# Altium project PiMX8MP_r0.3_release.PrjPcb (part 6 of 6)

## Sheet 16_FPC_Connector_Debug.SchDoc: FPC Debug Connector
size 420 x 297 mm; CheckedBy: TBD; Author: Lukas Henkel; DocumentNumber: 16; SheetNumber: 16; SheetTotal: 16; DocSize: A3
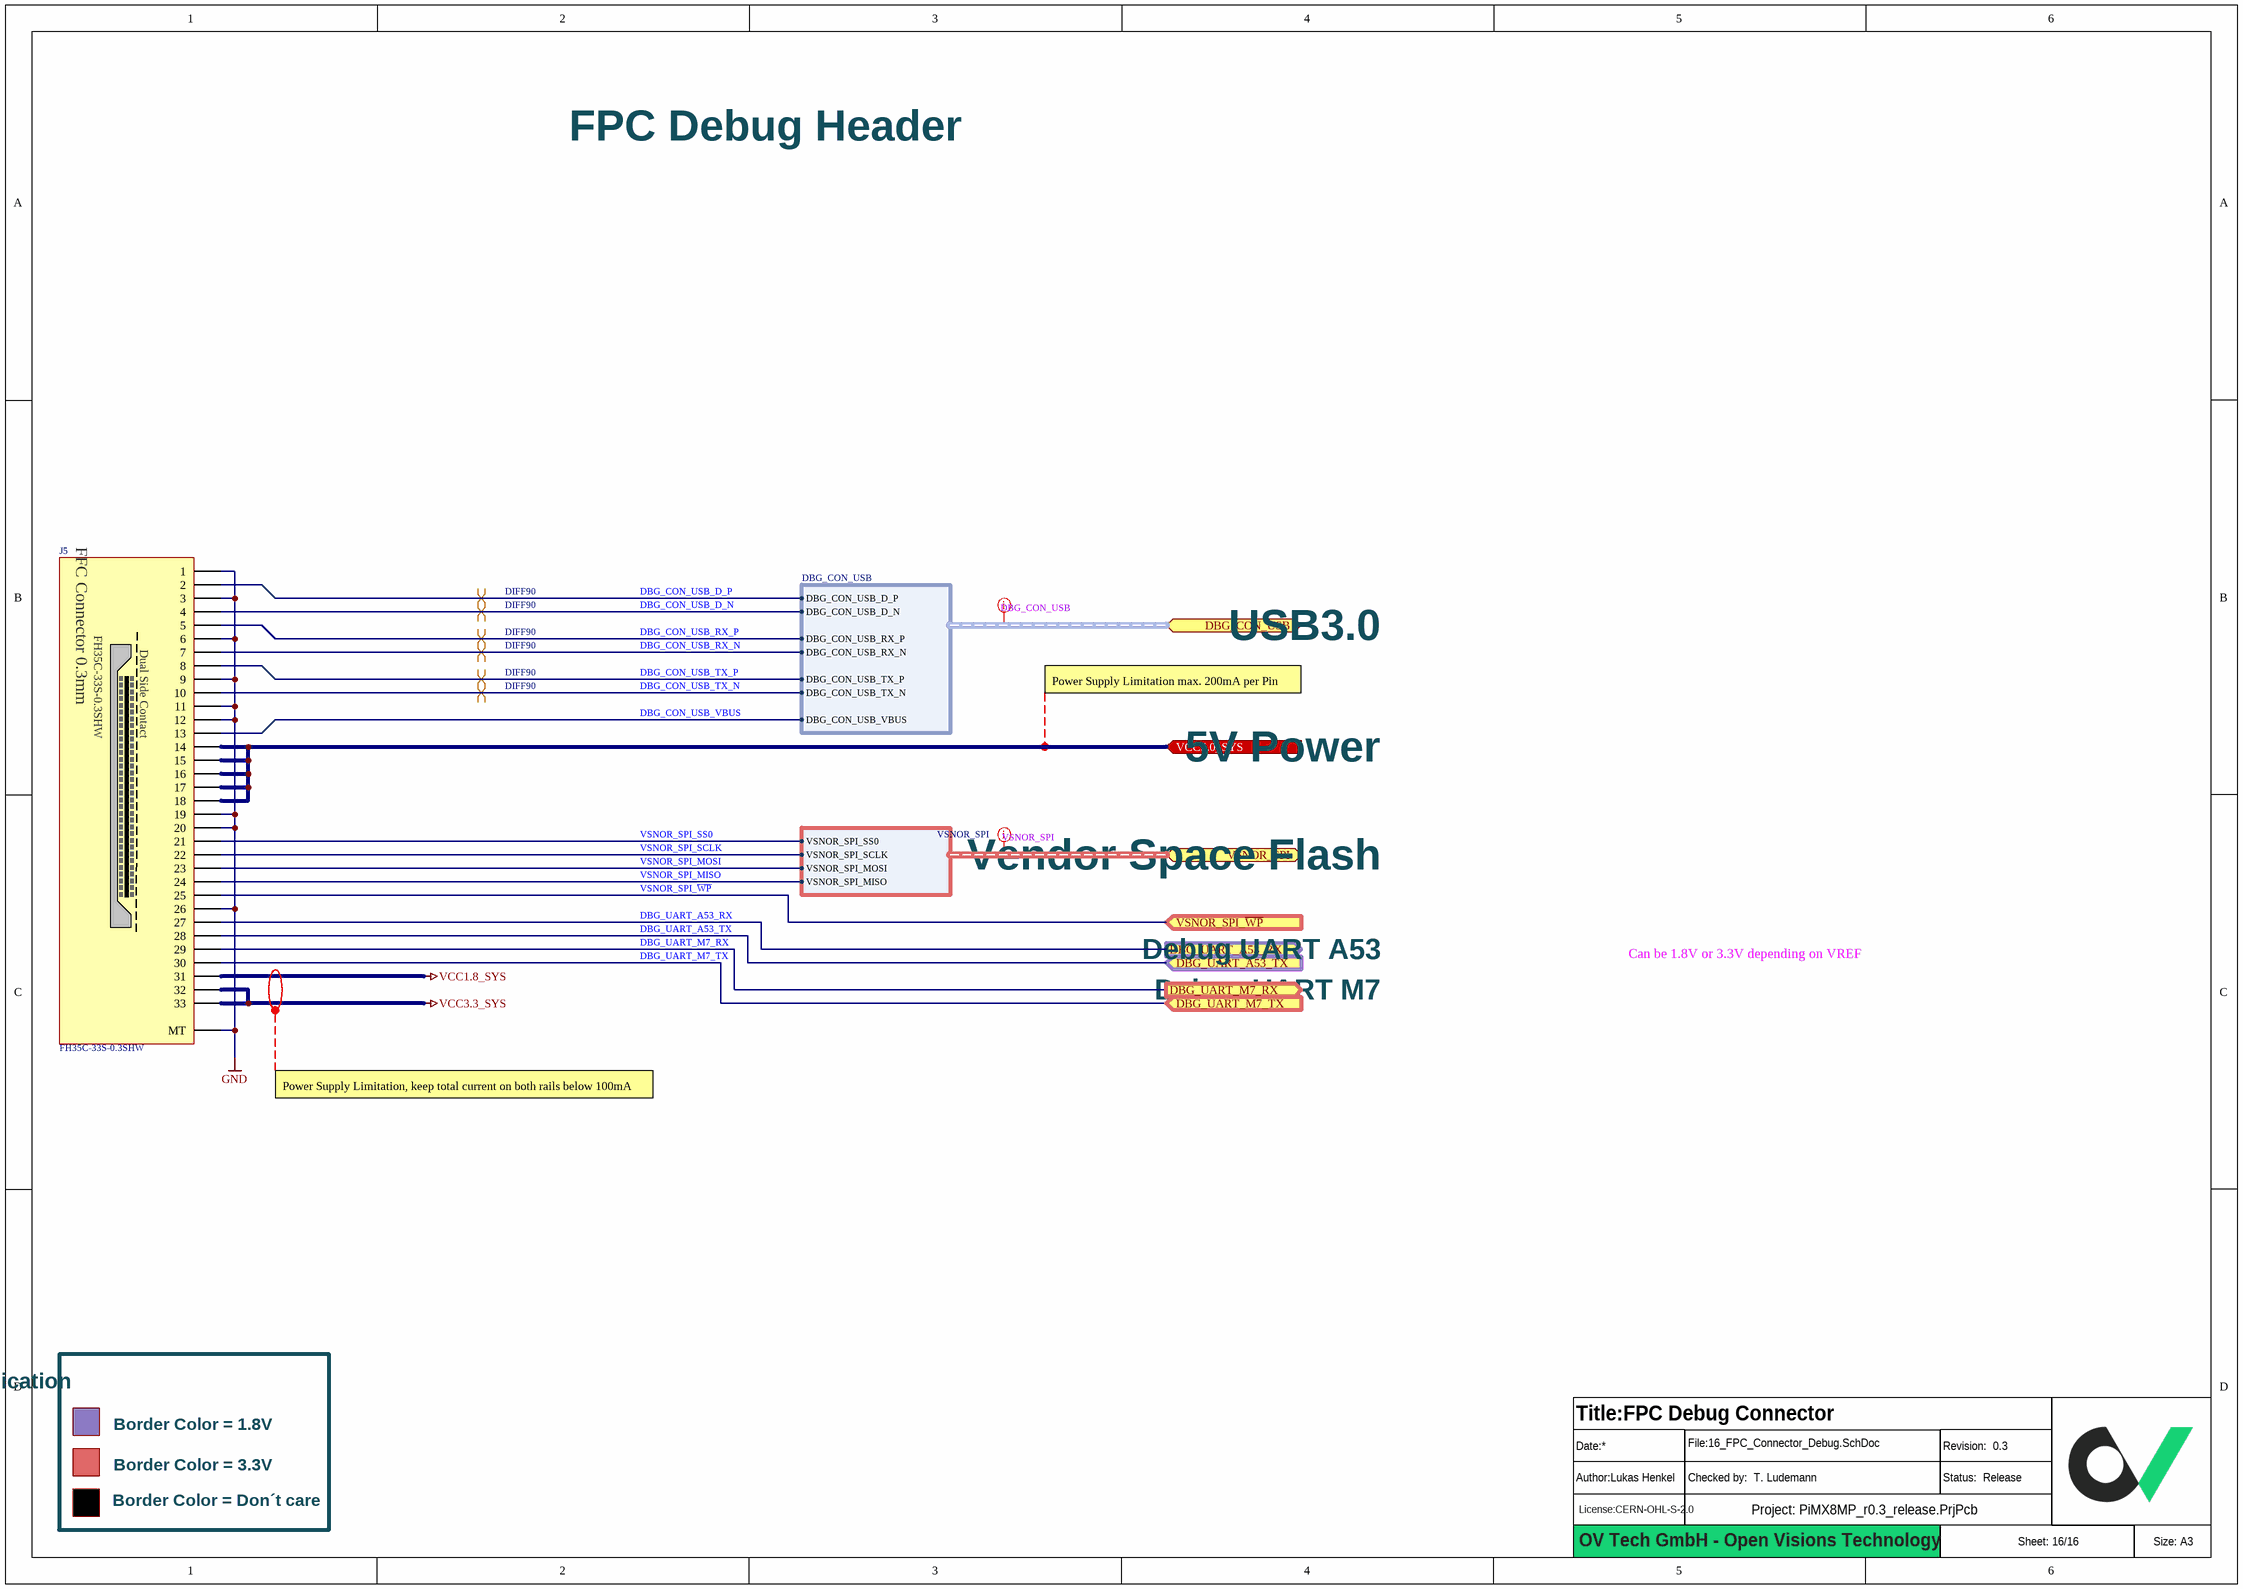
[diagram p16: 16_FPC_Connector_Debug.SchDoc]

### Parts
(Parts that share a designator on the sheet are numbered #1, #2 ... from top to bottom, then left to right.)
?#16  (no value)  (graphical)
J5  FH35C-33S-0.3SHW  [FFC 33pol 0.3mm FH35C-33S-0.3SHW]

### Ports
DBG_CON_USB (bidir, harness DBG_CON_USB), DBG_UART_A53_RX (out), DBG_UART_A53_TX (in), DBG_UART_M7_RX (out), DBG_UART_M7_TX (in), VCC5.0_SYS (in), VSNOR_SPI (bidir, harness VSNOR_SPI), VSNOR_SPI_~{WP} (in)

### Harnesses
DBG_CON_USB: DBG_CON_USB_VBUS, DBG_CON_USB_D_N, DBG_CON_USB_D_P, DBG_CON_USB_RX_N, DBG_CON_USB_RX_P, DBG_CON_USB_TX_N, DBG_CON_USB_TX_P
VSNOR_SPI: VSNOR_SPI_SS0, VSNOR_SPI_SCLK, VSNOR_SPI_MOSI, VSNOR_SPI_MISO

### Nets
GND: J5.1 J5.3 J5.6 J5.9 J5.11 J5.12 J5.19 J5.20 J5.26 J5.MT
VCC1.8_SYS: J5.31
VCC3.3_SYS: J5.32 J5.33
DBG_CON_USB_D_N: J5.4 ; port DBG_CON_USB.DBG_CON_USB_D_N
DBG_CON_USB_D_P: J5.2 ; port DBG_CON_USB.DBG_CON_USB_D_P
DBG_CON_USB_RX_N: J5.7 ; port DBG_CON_USB.DBG_CON_USB_RX_N
DBG_CON_USB_RX_P: J5.5 ; port DBG_CON_USB.DBG_CON_USB_RX_P
DBG_CON_USB_TX_N: J5.10 ; port DBG_CON_USB.DBG_CON_USB_TX_N
DBG_CON_USB_TX_P: J5.8 ; port DBG_CON_USB.DBG_CON_USB_TX_P
DBG_CON_USB_VBUS: J5.13 ; port DBG_CON_USB.DBG_CON_USB_VBUS
DBG_UART_A53_RX: J5.27 ; port DBG_UART_A53_RX
DBG_UART_A53_TX: J5.28 ; port DBG_UART_A53_TX
DBG_UART_M7_RX: J5.29 ; port DBG_UART_M7_RX
DBG_UART_M7_TX: J5.30 ; port DBG_UART_M7_TX
VCC5.0_SYS: J5.14 J5.15 J5.16 J5.17 J5.18 ; port VCC5.0_SYS
VSNOR_SPI_MISO: J5.24 ; port VSNOR_SPI.VSNOR_SPI_MISO
VSNOR_SPI_MOSI: J5.23 ; port VSNOR_SPI.VSNOR_SPI_MOSI
VSNOR_SPI_SCLK: J5.22 ; port VSNOR_SPI.VSNOR_SPI_SCLK
VSNOR_SPI_SS0: J5.21 ; port VSNOR_SPI.VSNOR_SPI_SS0
VSNOR_SPI_~{WP}: J5.25 ; port VSNOR_SPI_~{WP}

### Layout directives
net class DBG_CON_USB: (no net found under the mark)
differential pair; differential pair class DIFF90: DBG_CON_USB_D_N, DBG_CON_USB_D_P, DBG_CON_USB_RX_N, DBG_CON_USB_RX_P, DBG_CON_USB_TX_N, DBG_CON_USB_TX_P
net class VSNOR_SPI: (no net found under the mark)

### Notes on the sheet
- FPC Debug Header
- USB3.0
- Power Supply Limitation max. 200mA per Pin
- 5V Power
- Vendor Space Flash
- Debug UART A53
- Debug UART M7
- Can be 1.8V or 3.3V depending on VREF
- Power Supply Limitation, keep total current on both rails below 100mA
- Signal Level Indication
- Border Color = 1.8V
- Border Color = 3.3V
- Border Color = Don´t care
- OV Tech GmbH - Open Visions Technology
- (in symbol FFC Connector_33pol_FH35C-33S-0.3SHW) FFC Connector 0.3mm; Dual Side Contact

### Library data of the parts
?#16 = Titleblock_01_OpenSource
J5 = FFC Connector_33pol_FH35C-33S-0.3SHW: FFC Connector 33pol 0.3mm Pitch Double Sided Contacts; Manufacturer 1: Hirose Connector; Manufacturer 1 Prt. Nr.: FH35C-33S-0.3SHW(99)

## Nets that join several sheets
DRAM_VCC1.1: 02_8MPLUS_PMIC (5 pins), 03_8MPLUS_PWR (19 pins), 08_DRAM_LPDDR4 (64 pins)
GND: 02_8MPLUS_PMIC (39 pins), 03_8MPLUS_PWR (180 pins), 04_8MPLUS_DRAM (R10.1 R11.1), 05_8MPLUS_CFG (9 pins), 06_8MPLUS_IO (C107.2 C108.2 C109.2 U3.6), 07_8MPLUS_PHY (5 pins), 08_DRAM_LPDDR4 (84 pins), 09_eMMC_Flash (27 pins), 10_Gbit_Ethernet (34 pins), 11_WIFI_BLE_Module (45 pins), 12_Coral_Edge_TPU (105 pins), 13_Interface_Options (7 pins), 14_BTB_Connector_P1-P100 (33 pins), 15_BTB_Connector_P101-P200 (42 pins), 16_FPC_Connector_Debug (10 pins)
VCC1.8_SNVS: 02_8MPLUS_PMIC (C22.1 U1.3), 03_8MPLUS_PWR (C72.1 U2.R24), 05_8MPLUS_CFG (R16.2 R17.2 R18.2 R24.1), 14_BTB_Connector_P1-P100 (R160.2)
VCC1.8_SYS: 02_8MPLUS_PMIC (9 pins), 03_8MPLUS_PWR (15 pins), 05_8MPLUS_CFG (5 pins), 08_DRAM_LPDDR4 (14 pins), 09_eMMC_Flash (18 pins), 10_Gbit_Ethernet (R83.2), 11_WIFI_BLE_Module (R122.2), 12_Coral_Edge_TPU (C198.1 J6.8 R185.1), 14_BTB_Connector_P1-P100 (J3.88 J3.90), 15_BTB_Connector_P101-P200 (R164.2), 16_FPC_Connector_Debug (J5.31)
VCC3.3_SYS: 02_8MPLUS_PMIC (9 pins), 03_8MPLUS_PWR (7 pins), 06_8MPLUS_IO (C108.1 R37.2 R38.2 U3.11), 07_8MPLUS_PHY (R40.1), 09_eMMC_Flash (14 pins), 10_Gbit_Ethernet (8 pins), 11_WIFI_BLE_Module (7 pins), 13_Interface_Options (6 pins), 14_BTB_Connector_P1-P100 (5 pins), 15_BTB_Connector_P101-P200 (R162.2 R163.2 R165.2), 16_FPC_Connector_Debug (J5.32 J5.33)
VCC_ARM: 02_8MPLUS_PMIC (5 pins), 03_8MPLUS_PWR (27 pins)
VCC_SD2: 02_8MPLUS_PMIC (C32.1 R7.2 U1.55), 03_8MPLUS_PWR (C58.1 C59.1 U2.W24)
VCC_SOC: 02_8MPLUS_PMIC (8 pins), 03_8MPLUS_PWR (64 pins)
VCCA1.8_SYS: 02_8MPLUS_PMIC (C29.1 U1.54), 03_8MPLUS_PWR (25 pins), 05_8MPLUS_CFG (C30.1 R9.2 R112.2 U20.4)
8M_BOOT_MODE1: 05_8MPLUS_CFG (5 pins), 14_BTB_Connector_P1-P100 (J3.93)
8M_ONOFF: 05_8MPLUS_CFG (5 pins), 14_BTB_Connector_P1-P100 (R158.2)
ACT_LED_FET: 10_Gbit_Ethernet (R93.1 R100.2 U8.14), 14_BTB_Connector_P1-P100 (U12.5)
ANALOG_P1: 06_8MPLUS_IO (U2.A4), 14_BTB_Connector_P1-P100 (J3.94)
ANALOG_P2: 06_8MPLUS_IO (U2.B5), 14_BTB_Connector_P1-P100 (J3.96)
ANT_SEL: 06_8MPLUS_IO (U2.F6), 11_WIFI_BLE_Module (R115.2 R118.2 U11.6)
BB_CON_CAM0_CLK_N: 07_8MPLUS_PHY (U2.B23), 15_BTB_Connector_P101-P200 (J4.40)
BB_CON_CAM0_CLK_P: 07_8MPLUS_PHY (U2.A23), 15_BTB_Connector_P101-P200 (J4.42)
BB_CON_CAM0_D0_N: 07_8MPLUS_PHY (U2.B25), 15_BTB_Connector_P101-P200 (J4.28)
BB_CON_CAM0_D0_P: 07_8MPLUS_PHY (U2.A25), 15_BTB_Connector_P101-P200 (J4.30)
BB_CON_CAM0_D1_N: 07_8MPLUS_PHY (U2.B24), 15_BTB_Connector_P101-P200 (J4.34)
BB_CON_CAM0_D1_P: 07_8MPLUS_PHY (U2.A24), 15_BTB_Connector_P101-P200 (J4.36)
BB_CON_CAM1_CLK_N: 07_8MPLUS_PHY (U2.E22), 15_BTB_Connector_P101-P200 (J4.27)
BB_CON_CAM1_CLK_P: 07_8MPLUS_PHY (U2.D22), 15_BTB_Connector_P101-P200 (J4.29)
BB_CON_CAM1_D0_N: 07_8MPLUS_PHY (U2.E18), 15_BTB_Connector_P101-P200 (J4.15)
BB_CON_CAM1_D0_P: 07_8MPLUS_PHY (U2.D18), 15_BTB_Connector_P101-P200 (J4.17)
BB_CON_CAM1_D1_N: 07_8MPLUS_PHY (U2.E20), 15_BTB_Connector_P101-P200 (J4.21)
BB_CON_CAM1_D1_P: 07_8MPLUS_PHY (U2.D20), 15_BTB_Connector_P101-P200 (J4.23)
BB_CON_CAM1_D2_N: 07_8MPLUS_PHY (U2.E24), 15_BTB_Connector_P101-P200 (J4.33)
BB_CON_CAM1_D2_P: 07_8MPLUS_PHY (U2.D24), 15_BTB_Connector_P101-P200 (J4.35)
BB_CON_CAM1_D3_N: 07_8MPLUS_PHY (U2.E26), 15_BTB_Connector_P101-P200 (J4.39)
BB_CON_CAM1_D3_P: 07_8MPLUS_PHY (U2.D26), 15_BTB_Connector_P101-P200 (J4.41)
BB_CON_HDMI0_CEC_DYN: 07_8MPLUS_PHY (U2.AD22), 15_BTB_Connector_P101-P200 (D10.2 Q7.2 R173.1)
BB_CON_HDMI0_CLK_N: 07_8MPLUS_PHY (U2.AJ24), 15_BTB_Connector_P101-P200 (J4.90)
BB_CON_HDMI0_CLK_P: 07_8MPLUS_PHY (U2.AH24), 15_BTB_Connector_P101-P200 (J4.88)
BB_CON_HDMI0_HPD_DYN: 07_8MPLUS_PHY (U2.AE22), 15_BTB_Connector_P101-P200 (R168.1 U22.B2)
BB_CON_HDMI0_SCL_DYN: 07_8MPLUS_PHY (U2.AC22), 15_BTB_Connector_P101-P200 (R171.1 U18.2)
BB_CON_HDMI0_SDA_DYN: 07_8MPLUS_PHY (U2.AF22), 15_BTB_Connector_P101-P200 (R172.1 U18.3)
BB_CON_HDMI0_TX0_N: 07_8MPLUS_PHY (U2.AJ25), 15_BTB_Connector_P101-P200 (J4.84)
BB_CON_HDMI0_TX0_P: 07_8MPLUS_PHY (U2.AH25), 15_BTB_Connector_P101-P200 (J4.82)
BB_CON_HDMI0_TX1_N: 07_8MPLUS_PHY (U2.AJ26), 15_BTB_Connector_P101-P200 (J4.78)
BB_CON_HDMI0_TX1_P: 07_8MPLUS_PHY (U2.AH26), 15_BTB_Connector_P101-P200 (J4.76)
BB_CON_HDMI0_TX2_N: 07_8MPLUS_PHY (U2.AJ27), 15_BTB_Connector_P101-P200 (J4.72)
BB_CON_HDMI0_TX2_P: 07_8MPLUS_PHY (U2.AH27), 15_BTB_Connector_P101-P200 (J4.70)
BB_CON_LVDS/DSI_CLK_N: 13_Interface_Options (U16.10), 15_BTB_Connector_P101-P200 (J4.87)
BB_CON_LVDS/DSI_CLK_P: 13_Interface_Options (U16.11), 15_BTB_Connector_P101-P200 (J4.89)
BB_CON_LVDS/DSI_D0_N: 13_Interface_Options (U16.5), 15_BTB_Connector_P101-P200 (J4.75)
BB_CON_LVDS/DSI_D0_P: 13_Interface_Options (U16.6), 15_BTB_Connector_P101-P200 (J4.77)
BB_CON_LVDS/DSI_D1_N: 13_Interface_Options (U16.7), 15_BTB_Connector_P101-P200 (J4.81)
BB_CON_LVDS/DSI_D1_P: 13_Interface_Options (U16.8), 15_BTB_Connector_P101-P200 (J4.83)
BB_CON_LVDS/DSI_D2_N: 13_Interface_Options (U16.12), 15_BTB_Connector_P101-P200 (J4.93)
BB_CON_LVDS/DSI_D2_P: 13_Interface_Options (U16.13), 15_BTB_Connector_P101-P200 (J4.95)
BB_CON_LVDS/DSI_D3_N: 13_Interface_Options (U16.15), 15_BTB_Connector_P101-P200 (J4.94)
BB_CON_LVDS/DSI_D3_P: 13_Interface_Options (U16.14), 15_BTB_Connector_P101-P200 (J4.96)
BB_CON_PCIE_CLK_N: 13_Interface_Options (R147.1), 15_BTB_Connector_P101-P200 (J4.12)
BB_CON_PCIE_CLK_P: 13_Interface_Options (R146.1), 15_BTB_Connector_P101-P200 (J4.10)
BB_CON_PCIe_CLK_REQ: 06_8MPLUS_IO (U2.AF8), 15_BTB_Connector_P101-P200 (J4.2 R165.1)
BB_CON_PCIE_RST: 06_8MPLUS_IO (U2.AD8), 15_BTB_Connector_P101-P200 (J4.9 R163.1)
BB_CON_PCIE_RX_N: 13_Interface_Options (R143.1), 15_BTB_Connector_P101-P200 (J4.18)
BB_CON_PCIE_RX_P: 13_Interface_Options (R142.1), 15_BTB_Connector_P101-P200 (J4.16)
BB_CON_PCIEC_TX_N: 13_Interface_Options (R145.1), 15_BTB_Connector_P101-P200 (J4.24)
BB_CON_PCIEC_TX_P: 13_Interface_Options (R144.1), 15_BTB_Connector_P101-P200 (J4.22)
BB_CON_USB_D_N: 07_8MPLUS_PHY (R42.2), 15_BTB_Connector_P101-P200 (J4.3)
BB_CON_USB_D_P: 07_8MPLUS_PHY (R43.2), 15_BTB_Connector_P101-P200 (J4.5)
BB_CON_USB_ID: 06_8MPLUS_IO (U2.B7), 15_BTB_Connector_P101-P200 (D4.2 R164.1)
BT_DEVICE_WAKE: 06_8MPLUS_IO (U2.AE8), 11_WIFI_BLE_Module (U10.51)
BT_HOST_WAKE: 06_8MPLUS_IO (U2.A7), 11_WIFI_BLE_Module (R183.1 R184.2)
BT_PCM_CLK: 06_8MPLUS_IO (U3.8), 11_WIFI_BLE_Module (U10.7)
BT_PCM_IN: 06_8MPLUS_IO (U3.9), 11_WIFI_BLE_Module (U10.6)
BT_PCM_OUT: 06_8MPLUS_IO (U3.7), 11_WIFI_BLE_Module (U10.9)
BT_PCM_SYNC: 06_8MPLUS_IO (U3.10), 11_WIFI_BLE_Module (U10.8)
BT_REG_EN: 06_8MPLUS_IO (U2.AA29), 11_WIFI_BLE_Module (C177.1 R106.1 U10.68), 14_BTB_Connector_P1-P100 (J3.91)
BT_UART_CTS_N: 06_8MPLUS_IO (U2.W25), 11_WIFI_BLE_Module (U10.11)
BT_UART_RTS_N: 06_8MPLUS_IO (U2.W26), 11_WIFI_BLE_Module (U10.13)
BT_UART_RXD: 06_8MPLUS_IO (U2.AA28), 11_WIFI_BLE_Module (U10.12)
BT_UART_TXD: 06_8MPLUS_IO (U2.U25), 11_WIFI_BLE_Module (U10.10)
CAMERA_GPIO: 06_8MPLUS_IO (U2.AE6), 14_BTB_Connector_P1-P100 (J3.97)
CM4_GPIO0: 06_8MPLUS_IO (U2.AF14), 14_BTB_Connector_P1-P100 (J3.36)
CM4_GPIO1: 06_8MPLUS_IO (U2.AE16), 14_BTB_Connector_P1-P100 (J3.35)
CM4_GPIO2: 06_8MPLUS_IO (U2.AD14), 14_BTB_Connector_P1-P100 (J3.58)
CM4_GPIO3: 06_8MPLUS_IO (U2.AC14), 14_BTB_Connector_P1-P100 (J3.56)
CM4_GPIO4: 06_8MPLUS_IO (U2.AH14), 14_BTB_Connector_P1-P100 (J3.54)
CM4_GPIO5: 06_8MPLUS_IO (U2.AJ12), 14_BTB_Connector_P1-P100 (J3.34)
CM4_GPIO6: 06_8MPLUS_IO (U2.AF12), 14_BTB_Connector_P1-P100 (J3.30)
CM4_GPIO7: 06_8MPLUS_IO (U2.AJ10), 14_BTB_Connector_P1-P100 (J3.37)
CM4_GPIO8: 06_8MPLUS_IO (U2.AJ22), 14_BTB_Connector_P1-P100 (J3.39)
CM4_GPIO9: 06_8MPLUS_IO (U2.AH20), 14_BTB_Connector_P1-P100 (J3.40)
CM4_GPIO10: 06_8MPLUS_IO (U2.AJ21), 14_BTB_Connector_P1-P100 (J3.44)
CM4_GPIO11: 06_8MPLUS_IO (U2.AH21), 14_BTB_Connector_P1-P100 (J3.38)
CM4_GPIO12: 06_8MPLUS_IO (R32.1 U2.AJ11), 14_BTB_Connector_P1-P100 (J3.31)
CM4_GPIO13: 06_8MPLUS_IO (R33.1 U2.AH11), 14_BTB_Connector_P1-P100 (J3.28)
CM4_GPIO14: 06_8MPLUS_IO (R36.1 U2.AC16), 14_BTB_Connector_P1-P100 (J3.55)
CM4_GPIO15: 06_8MPLUS_IO (R34.1 U2.AH19), 14_BTB_Connector_P1-P100 (J3.51)
CM4_GPIO16: 06_8MPLUS_IO (U2.AH10), 14_BTB_Connector_P1-P100 (J3.29)
CM4_GPIO17: 06_8MPLUS_IO (U2.AH13), 14_BTB_Connector_P1-P100 (J3.50)
CM4_GPIO18: 06_8MPLUS_IO (R35.1 U2.AE20), 14_BTB_Connector_P1-P100 (J3.49)
CM4_GPIO19: 06_8MPLUS_IO (R31.1 U2.AD20), 14_BTB_Connector_P1-P100 (J3.26)
CM4_GPIO20: 06_8MPLUS_IO (U2.AC20), 14_BTB_Connector_P1-P100 (J3.27)
CM4_GPIO21: 06_8MPLUS_IO (U2.AF20), 14_BTB_Connector_P1-P100 (J3.25)
CM4_GPIO22: 06_8MPLUS_IO (U2.AH9), 14_BTB_Connector_P1-P100 (J3.46)
CM4_GPIO23: 06_8MPLUS_IO (U2.AD10), 14_BTB_Connector_P1-P100 (J3.47)
CM4_GPIO24: 06_8MPLUS_IO (U2.AD12), 14_BTB_Connector_P1-P100 (J3.45)
CM4_GPIO25: 06_8MPLUS_IO (U2.AE10), 14_BTB_Connector_P1-P100 (J3.41)
CM4_GPIO26: 06_8MPLUS_IO (U2.AH12), 14_BTB_Connector_P1-P100 (J3.24)
CM4_GPIO27: 06_8MPLUS_IO (U2.AJ8), 14_BTB_Connector_P1-P100 (J3.48)
CON_SCL0: 13_Interface_Options (R149.1 U17.16), 14_BTB_Connector_P1-P100 (J3.80)
CON_SDA0: 13_Interface_Options (R150.1 U17.3), 14_BTB_Connector_P1-P100 (J3.82)
CPU_ACIVITY_LED: 06_8MPLUS_IO (U2.A5), 14_BTB_Connector_P1-P100 (R151.1 R152.1)
DBG_CON_USB_D_N: 07_8MPLUS_PHY (U2.E14), 16_FPC_Connector_Debug (J5.4)
DBG_CON_USB_D_P: 07_8MPLUS_PHY (U2.D14), 16_FPC_Connector_Debug (J5.2)
DBG_CON_USB_RX_N: 07_8MPLUS_PHY (U2.B12), 16_FPC_Connector_Debug (J5.7)
DBG_CON_USB_RX_P: 07_8MPLUS_PHY (U2.A12), 16_FPC_Connector_Debug (J5.5)
DBG_CON_USB_TX_N: 07_8MPLUS_PHY (C112.2), 16_FPC_Connector_Debug (J5.10)
DBG_CON_USB_TX_P: 07_8MPLUS_PHY (C113.2), 16_FPC_Connector_Debug (J5.8)
DBG_CON_USB_VBUS: 07_8MPLUS_PHY (U2.D12), 16_FPC_Connector_Debug (J5.13)
DBG_UART_A53_RX: 06_8MPLUS_IO (R34.2), 16_FPC_Connector_Debug (J5.27)
DBG_UART_A53_TX: 06_8MPLUS_IO (R36.2), 16_FPC_Connector_Debug (J5.28)
DBG_UART_M7_RX: 06_8MPLUS_IO (U2.AJ5), 16_FPC_Connector_Debug (J5.29)
DBG_UART_M7_TX: 06_8MPLUS_IO (U2.AH5), 16_FPC_Connector_Debug (J5.30)
DRAM_A_CA0: 04_8MPLUS_DRAM (U2.L6), 08_DRAM_LPDDR4 (U4.R2)
DRAM_A_CA1: 04_8MPLUS_DRAM (U2.L4), 08_DRAM_LPDDR4 (U4.P2)
DRAM_A_CA2: 04_8MPLUS_DRAM (U2.E4), 08_DRAM_LPDDR4 (U4.R9)
DRAM_A_CA3: 04_8MPLUS_DRAM (U2.D4), 08_DRAM_LPDDR4 (U4.R10)
DRAM_A_CA4: 04_8MPLUS_DRAM (U2.N4), 08_DRAM_LPDDR4 (U4.R11)
DRAM_A_CA5: 04_8MPLUS_DRAM (U2.N5), 08_DRAM_LPDDR4 (U4.P11)
DRAM_A_CKE0: 04_8MPLUS_DRAM (U2.J6), 08_DRAM_LPDDR4 (R53.2 U4.P4)
DRAM_A_CKE1: 04_8MPLUS_DRAM (U2.G5), 08_DRAM_LPDDR4 (R52.2 U4.P5)
DRAM_A_CLK_N: 04_8MPLUS_DRAM (U2.M2), 08_DRAM_LPDDR4 (R56.2 U4.P9)
DRAM_A_CLK_P: 04_8MPLUS_DRAM (U2.M1), 08_DRAM_LPDDR4 (R56.1 U4.P8)
DRAM_A_CS0: 04_8MPLUS_DRAM (U2.N6), 08_DRAM_LPDDR4 (U4.R4)
DRAM_A_CS1: 04_8MPLUS_DRAM (U2.J4), 08_DRAM_LPDDR4 (U4.R3)
DRAM_A_DATA0: 04_8MPLUS_DRAM (U2.B3), 08_DRAM_LPDDR4 (U4.AA11)
DRAM_A_DATA1: 04_8MPLUS_DRAM (U2.A2), 08_DRAM_LPDDR4 (U4.Y11)
DRAM_A_DATA2: 04_8MPLUS_DRAM (U2.E1), 08_DRAM_LPDDR4 (U4.V11)
DRAM_A_DATA3: 04_8MPLUS_DRAM (U2.F2), 08_DRAM_LPDDR4 (U4.U11)
DRAM_A_DATA4: 04_8MPLUS_DRAM (U2.E2), 08_DRAM_LPDDR4 (U4.U9)
DRAM_A_DATA5: 04_8MPLUS_DRAM (U2.C1), 08_DRAM_LPDDR4 (U4.V9)
DRAM_A_DATA6: 04_8MPLUS_DRAM (U2.C2), 08_DRAM_LPDDR4 (U4.Y9)
DRAM_A_DATA7: 04_8MPLUS_DRAM (U2.B1), 08_DRAM_LPDDR4 (U4.AA9)
DRAM_A_DATA8: 04_8MPLUS_DRAM (U2.G1), 08_DRAM_LPDDR4 (U4.AA2)
DRAM_A_DATA9: 04_8MPLUS_DRAM (U2.H1), 08_DRAM_LPDDR4 (U4.Y2)
DRAM_A_DATA10: 04_8MPLUS_DRAM (U2.K1), 08_DRAM_LPDDR4 (U4.V2)
DRAM_A_DATA11: 04_8MPLUS_DRAM (U2.K2), 08_DRAM_LPDDR4 (U4.U2)
DRAM_A_DATA12: 04_8MPLUS_DRAM (U2.L2), 08_DRAM_LPDDR4 (U4.U4)
DRAM_A_DATA13: 04_8MPLUS_DRAM (U2.L1), 08_DRAM_LPDDR4 (U4.V4)
DRAM_A_DATA14: 04_8MPLUS_DRAM (U2.G2), 08_DRAM_LPDDR4 (U4.Y4)
DRAM_A_DATA15: 04_8MPLUS_DRAM (U2.F1), 08_DRAM_LPDDR4 (U4.AA4)
DRAM_A_DMI0: 04_8MPLUS_DRAM (U2.B2), 08_DRAM_LPDDR4 (U4.Y10)
DRAM_A_DMI1: 04_8MPLUS_DRAM (U2.H2), 08_DRAM_LPDDR4 (U4.Y3)
DRAM_A_DQS0_N: 04_8MPLUS_DRAM (U2.D1), 08_DRAM_LPDDR4 (U4.V10)
DRAM_A_DQS0_P: 04_8MPLUS_DRAM (U2.D2), 08_DRAM_LPDDR4 (U4.W10)
DRAM_A_DQS1_N: 04_8MPLUS_DRAM (U2.J1), 08_DRAM_LPDDR4 (U4.V3)
DRAM_A_DQS1_P: 04_8MPLUS_DRAM (U2.J2), 08_DRAM_LPDDR4 (U4.W3)
DRAM_B_CA0: 04_8MPLUS_DRAM (U2.W4), 08_DRAM_LPDDR4 (U4.H2)
DRAM_B_CA1: 04_8MPLUS_DRAM (U2.W5), 08_DRAM_LPDDR4 (U4.J2)
DRAM_B_CA2: 04_8MPLUS_DRAM (U2.AE4), 08_DRAM_LPDDR4 (U4.H9)
DRAM_B_CA3: 04_8MPLUS_DRAM (U2.AF4), 08_DRAM_LPDDR4 (U4.H10)
DRAM_B_CA4: 04_8MPLUS_DRAM (U2.U5), 08_DRAM_LPDDR4 (U4.H11)
DRAM_B_CA5: 04_8MPLUS_DRAM (U2.U6), 08_DRAM_LPDDR4 (U4.J11)
DRAM_B_CKE0: 04_8MPLUS_DRAM (U2.AA4), 08_DRAM_LPDDR4 (R50.2 U4.J4)
DRAM_B_CKE1: 04_8MPLUS_DRAM (U2.AA5), 08_DRAM_LPDDR4 (R49.2 U4.J5)
DRAM_B_CLK_N: 04_8MPLUS_DRAM (U2.V1), 08_DRAM_LPDDR4 (R57.2 U4.J9)
DRAM_B_CLK_P: 04_8MPLUS_DRAM (U2.V2), 08_DRAM_LPDDR4 (R57.1 U4.J8)
DRAM_B_CS0: 04_8MPLUS_DRAM (U2.U4), 08_DRAM_LPDDR4 (U4.H4)
DRAM_B_CS1: 04_8MPLUS_DRAM (U2.AA6), 08_DRAM_LPDDR4 (U4.H3)
DRAM_B_DATA0: 04_8MPLUS_DRAM (U2.AC1), 08_DRAM_LPDDR4 (U4.B2)
DRAM_B_DATA1: 04_8MPLUS_DRAM (U2.AB1), 08_DRAM_LPDDR4 (U4.C2)
DRAM_B_DATA2: 04_8MPLUS_DRAM (U2.Y1), 08_DRAM_LPDDR4 (U4.E2)
DRAM_B_DATA3: 04_8MPLUS_DRAM (U2.Y2), 08_DRAM_LPDDR4 (U4.F2)
DRAM_B_DATA4: 04_8MPLUS_DRAM (U2.W2), 08_DRAM_LPDDR4 (U4.F4)
DRAM_B_DATA5: 04_8MPLUS_DRAM (U2.W1), 08_DRAM_LPDDR4 (U4.E4)
DRAM_B_DATA6: 04_8MPLUS_DRAM (U2.AC2), 08_DRAM_LPDDR4 (U4.C4)
DRAM_B_DATA7: 04_8MPLUS_DRAM (U2.AD1), 08_DRAM_LPDDR4 (U4.B4)
DRAM_B_DATA8: 04_8MPLUS_DRAM (U2.AH3), 08_DRAM_LPDDR4 (U4.B11)
DRAM_B_DATA9: 04_8MPLUS_DRAM (U2.AJ2), 08_DRAM_LPDDR4 (U4.C11)
DRAM_B_DATA10: 04_8MPLUS_DRAM (U2.AE1), 08_DRAM_LPDDR4 (U4.E11)
DRAM_B_DATA11: 04_8MPLUS_DRAM (U2.AD2), 08_DRAM_LPDDR4 (U4.F11)
DRAM_B_DATA12: 04_8MPLUS_DRAM (U2.AE2), 08_DRAM_LPDDR4 (U4.F9)
DRAM_B_DATA13: 04_8MPLUS_DRAM (U2.AG1), 08_DRAM_LPDDR4 (U4.E9)
DRAM_B_DATA14: 04_8MPLUS_DRAM (U2.AG2), 08_DRAM_LPDDR4 (U4.C9)
DRAM_B_DATA15: 04_8MPLUS_DRAM (U2.AH1), 08_DRAM_LPDDR4 (U4.B9)
DRAM_B_DMI0: 04_8MPLUS_DRAM (U2.AB2), 08_DRAM_LPDDR4 (U4.C3)
DRAM_B_DMI1: 04_8MPLUS_DRAM (U2.AH2), 08_DRAM_LPDDR4 (U4.C10)
DRAM_B_DQS0_N: 04_8MPLUS_DRAM (U2.AA1), 08_DRAM_LPDDR4 (U4.E3)
DRAM_B_DQS0_P: 04_8MPLUS_DRAM (U2.AA2), 08_DRAM_LPDDR4 (U4.D3)
DRAM_B_DQS1_N: 04_8MPLUS_DRAM (U2.AF1), 08_DRAM_LPDDR4 (U4.E10)
DRAM_B_DQS1_P: 04_8MPLUS_DRAM (U2.AF2), 08_DRAM_LPDDR4 (U4.D10)
DRAM_RESET: 04_8MPLUS_DRAM (R10.2 TP23.TP U2.T1), 08_DRAM_LPDDR4 (U4.T11)
DSI1_CLK_N: 07_8MPLUS_PHY (U2.B18), 13_Interface_Options (U16.34)
DSI1_CLK_P: 07_8MPLUS_PHY (U2.A18), 13_Interface_Options (U16.33)
DSI1_D0_N: 07_8MPLUS_PHY (U2.B16), 13_Interface_Options (U16.38)
DSI1_D0_P: 07_8MPLUS_PHY (U2.A16), 13_Interface_Options (U16.37)
DSI1_D1_N: 07_8MPLUS_PHY (U2.B17), 13_Interface_Options (U16.36)
DSI1_D1_P: 07_8MPLUS_PHY (U2.A17), 13_Interface_Options (U16.35)
DSI1_D2_N: 07_8MPLUS_PHY (U2.B19), 13_Interface_Options (U16.32)
DSI1_D2_P: 07_8MPLUS_PHY (U2.A19), 13_Interface_Options (U16.31)
DSI1_D3_N: 07_8MPLUS_PHY (U2.B20), 13_Interface_Options (U16.18)
DSI1_D3_P: 07_8MPLUS_PHY (U2.A20), 13_Interface_Options (U16.19)
ENET_125O_SYNCE: 10_Gbit_Ethernet (R98.1 TP70.TP), 14_BTB_Connector_P1-P100 (J3.16)
ENET_~{INT}: 06_8MPLUS_IO (U2.A3), 10_Gbit_Ethernet (R75.1 TP67.TP U8.39)
ENET_LED1_ACTIVITY: 10_Gbit_Ethernet (R94.1 R101.2 U8.18), 14_BTB_Connector_P1-P100 (U12.1)
ENET_LED2_LINK: 10_Gbit_Ethernet (R95.1 R102.2 U8.16), 14_BTB_Connector_P1-P100 (U12.3)
ENET_LED3/GPIO2: 10_Gbit_Ethernet (R96.1 R103.2 TP71.TP U8.15), 14_BTB_Connector_P1-P100 (J3.18)
ENET_MDC: 06_8MPLUS_IO (U2.AH28), 10_Gbit_Ethernet (TP61.TP U8.37)
ENET_MDIO: 06_8MPLUS_IO (U2.AH29), 10_Gbit_Ethernet (R73.1 TP63.TP U8.38)
ENET_~{RST}: 02_8MPLUS_PMIC (R3.2), 10_Gbit_Ethernet (R74.1 TP64.TP U8.43)
ENET_RD0: 06_8MPLUS_IO (U2.AG29), 10_Gbit_Ethernet (R76.1)
ENET_RD1: 06_8MPLUS_IO (U2.AG28), 10_Gbit_Ethernet (R77.1)
ENET_RD2: 06_8MPLUS_IO (U2.AF29), 10_Gbit_Ethernet (R78.1)
ENET_RD3: 06_8MPLUS_IO (U2.AF28), 10_Gbit_Ethernet (R79.1)
ENET_RX_CTL: 06_8MPLUS_IO (U2.AE28), 10_Gbit_Ethernet (R82.1)
ENET_RXC: 06_8MPLUS_IO (U2.AE29), 10_Gbit_Ethernet (R81.1)
ENET_TD0: 06_8MPLUS_IO (U2.AC25), 10_Gbit_Ethernet (R177.1)
ENET_TD1: 06_8MPLUS_IO (U2.AE26), 10_Gbit_Ethernet (R178.1)
ENET_TD2: 06_8MPLUS_IO (U2.AF26), 10_Gbit_Ethernet (R179.1)
ENET_TD3: 06_8MPLUS_IO (U2.AD24), 10_Gbit_Ethernet (R180.1)
ENET_TX_CTL: 06_8MPLUS_IO (U2.AF24), 10_Gbit_Ethernet (R182.1)
ENET_TXC: 06_8MPLUS_IO (U2.AE24), 10_Gbit_Ethernet (R181.1)
ETH_TRX0_N: 10_Gbit_Ethernet (U8.3), 14_BTB_Connector_P1-P100 (J3.10)
ETH_TRX0_P: 10_Gbit_Ethernet (U8.2), 14_BTB_Connector_P1-P100 (J3.12)
ETH_TRX1_N: 10_Gbit_Ethernet (U8.6), 14_BTB_Connector_P1-P100 (J3.6)
ETH_TRX1_P: 10_Gbit_Ethernet (U8.5), 14_BTB_Connector_P1-P100 (J3.4)
ETH_TRX2_N: 10_Gbit_Ethernet (U8.8), 14_BTB_Connector_P1-P100 (J3.9)
ETH_TRX2_P: 10_Gbit_Ethernet (U8.7), 14_BTB_Connector_P1-P100 (J3.11)
ETH_TRX3_N: 10_Gbit_Ethernet (U8.11), 14_BTB_Connector_P1-P100 (J3.5)
ETH_TRX3_P: 10_Gbit_Ethernet (U8.10), 14_BTB_Connector_P1-P100 (J3.3)
GPIO_VREF: 03_8MPLUS_PWR (7 pins), 06_8MPLUS_IO (C107.1 U3.1 U3.12), 14_BTB_Connector_P1-P100 (J3.78), 15_BTB_Connector_P101-P200 (9 pins)
LVDS0_CLK_N: 07_8MPLUS_PHY (U2.G28), 13_Interface_Options (U16.25)
LVDS0_CLK_P: 07_8MPLUS_PHY (U2.F29), 13_Interface_Options (U16.24)
LVDS0_TX0_N: 07_8MPLUS_PHY (U2.E28), 13_Interface_Options (U16.29)
LVDS0_TX0_P: 07_8MPLUS_PHY (U2.D29), 13_Interface_Options (U16.28)
LVDS0_TX1_N: 07_8MPLUS_PHY (U2.F28), 13_Interface_Options (U16.27)
LVDS0_TX1_P: 07_8MPLUS_PHY (U2.E29), 13_Interface_Options (U16.26)
LVDS0_TX2_N: 07_8MPLUS_PHY (U2.H28), 13_Interface_Options (U16.23)
LVDS0_TX2_P: 07_8MPLUS_PHY (U2.G29), 13_Interface_Options (U16.22)
LVDS0_TX3_N: 07_8MPLUS_PHY (U2.J28), 13_Interface_Options (U16.20)
LVDS0_TX3_P: 07_8MPLUS_PHY (U2.H29), 13_Interface_Options (U16.21)
LVDS/DSI_SEL: 06_8MPLUS_IO (U2.E8), 13_Interface_Options (R148.2 TP94.TP U16.17)
PCIE_CLK_N: 07_8MPLUS_PHY (U2.E16), 13_Interface_Options (R141.1 R147.2)
PCIE_CLK_P: 07_8MPLUS_PHY (U2.D16), 13_Interface_Options (R140.1 R146.2)
PCIE_RX_N: 07_8MPLUS_PHY (U2.B14), 13_Interface_Options (R137.1 R143.2)
PCIE_RX_P: 07_8MPLUS_PHY (U2.A14), 13_Interface_Options (R136.1 R142.2)
PCIEC_TX_N: 07_8MPLUS_PHY (C110.2), 13_Interface_Options (R139.1 R145.2)
PCIEC_TX_P: 07_8MPLUS_PHY (C111.2), 13_Interface_Options (R138.1 R144.2)
PMIC_32K_OUT: 02_8MPLUS_PMIC (TP10.TP U1.7), 05_8MPLUS_CFG (U2.J25), 11_WIFI_BLE_Module (U12.11)
PMIC_INT_B: 02_8MPLUS_PMIC (R4.2 TP11.TP U1.13), 06_8MPLUS_IO (U2.D6)
PMIC_ON_REQ: 02_8MPLUS_PMIC (TP15.TP U1.39), 05_8MPLUS_CFG (R18.1 U2.F22)
PMIC_POR_B: 02_8MPLUS_PMIC (R3.1 TP12.TP U1.9), 05_8MPLUS_CFG (R17.1 U2.J29), 14_BTB_Connector_P1-P100 (D2.2 R157.1 U12.13)
PMIC_SCL: 02_8MPLUS_PMIC (R176.1 TP8.TP U1.41), 06_8MPLUS_IO (U2.AC8)
PMIC_SDA: 02_8MPLUS_PMIC (R175.1 TP9.TP U1.42), 06_8MPLUS_IO (U2.AH7)
PMIC_STBY_REQ: 02_8MPLUS_PMIC (TP14.TP U1.40), 05_8MPLUS_CFG (U2.J24)
R_SNSP1: 02_8MPLUS_PMIC (R2.1 TP6.TP U1.38), 03_8MPLUS_PWR (NT2.1)
R_SNSP2: 02_8MPLUS_PMIC (R1.1 TP3.TP U1.44), 03_8MPLUS_PWR (NT1.1)
SCI_I2C_SCL: 06_8MPLUS_IO (R38.1 U2.AJ7), 13_Interface_Options (R149.2 U17.10)
SCI_I2C_SDA: 06_8MPLUS_IO (R37.1 U2.AJ6), 13_Interface_Options (R150.2 U17.9)
SD2_CD_B: 06_8MPLUS_IO (U2.AD29), 14_BTB_Connector_P1-P100 (J3.76 R25.1)
SD2_CLK: 06_8MPLUS_IO (U2.AB29), 14_BTB_Connector_P1-P100 (J3.57)
SD2_CMD: 06_8MPLUS_IO (U2.AB28), 14_BTB_Connector_P1-P100 (J3.62)
SD2_DATA0: 06_8MPLUS_IO (U2.AC28), 14_BTB_Connector_P1-P100 (J3.63)
SD2_DATA1: 06_8MPLUS_IO (U2.AC29), 14_BTB_Connector_P1-P100 (J3.67)
SD2_DATA2: 06_8MPLUS_IO (U2.AA26), 14_BTB_Connector_P1-P100 (J3.69)
SD2_DATA3: 06_8MPLUS_IO (U2.AA25), 14_BTB_Connector_P1-P100 (J3.61)
SD2_RESET: 02_8MPLUS_PMIC (R7.1 U1.12), 06_8MPLUS_IO (U2.AD28)
SD2_VSEL: 02_8MPLUS_PMIC (R6.1 U1.29), 14_BTB_Connector_P1-P100 (R153.1)
SD3_CLK: 06_8MPLUS_IO (U2.U28), 09_eMMC_Flash (R59.1 U5.M6)
SD3_CMD: 06_8MPLUS_IO (U2.U29), 09_eMMC_Flash (U5.M5)
SD3_DATA0: 06_8MPLUS_IO (U2.P29), 09_eMMC_Flash (R58.1 U5.A3)
SD3_DATA1: 06_8MPLUS_IO (U2.N29), 09_eMMC_Flash (U5.A4)
SD3_DATA2: 06_8MPLUS_IO (U2.M29), 09_eMMC_Flash (U5.A5)
SD3_DATA3: 06_8MPLUS_IO (U2.R29), 09_eMMC_Flash (U5.B2)
SD3_DATA4: 06_8MPLUS_IO (U2.R28), 09_eMMC_Flash (U5.B3)
SD3_DATA5: 06_8MPLUS_IO (U2.P28), 09_eMMC_Flash (U5.B4)
SD3_DATA6: 06_8MPLUS_IO (U2.N28), 09_eMMC_Flash (U5.B5)
SD3_DATA7: 06_8MPLUS_IO (U2.M28), 09_eMMC_Flash (U5.B6)
SD3_RESET: 06_8MPLUS_IO (U2.T28), 09_eMMC_Flash (R60.1 U5.K5)
SD3_STROBE: 06_8MPLUS_IO (U2.T29), 09_eMMC_Flash (R61.2 U5.H5)
SD_PWR_ON: 02_8MPLUS_PMIC (C33.1 U1.23), 14_BTB_Connector_P1-P100 (J3.75)
SDIO_CLK: 06_8MPLUS_IO (U2.W28), 11_WIFI_BLE_Module (U10.33)
SDIO_CMD: 06_8MPLUS_IO (U2.W29), 11_WIFI_BLE_Module (R107.1 U10.28)
SDIO_DATA_0: 06_8MPLUS_IO (U2.Y29), 11_WIFI_BLE_Module (R111.1 U10.30)
SDIO_DATA_1: 06_8MPLUS_IO (U2.Y28), 11_WIFI_BLE_Module (R110.1 U10.29)
SDIO_DATA_2: 06_8MPLUS_IO (U2.V29), 11_WIFI_BLE_Module (R109.1 U10.32)
SDIO_DATA_3: 06_8MPLUS_IO (U2.V28), 11_WIFI_BLE_Module (R108.1 U10.31)
SYS_RST: 02_8MPLUS_PMIC (TP16.TP U1.8), 14_BTB_Connector_P1-P100 (R159.2)
TPU_EN: 06_8MPLUS_IO (U2.A8), 12_Coral_Edge_TPU (J6.6 R135.2)
TPU_INTR: 06_8MPLUS_IO (U2.E6), 12_Coral_Edge_TPU (TP88.TP U13.77)
TPU_PCIe_CLK_N: 12_Coral_Edge_TPU (U13.10), 13_Interface_Options (R141.2)
TPU_PCIe_CLK_P: 12_Coral_Edge_TPU (U13.11), 13_Interface_Options (R140.2)
TPU_PCIe_RX_N: 12_Coral_Edge_TPU (U13.8), 13_Interface_Options (R139.2)
TPU_PCIe_RX_P: 12_Coral_Edge_TPU (U13.7), 13_Interface_Options (R138.2)
TPU_PCIe_TX_N: 12_Coral_Edge_TPU (U13.4), 13_Interface_Options (R137.2)
TPU_PCIe_TX_P: 12_Coral_Edge_TPU (U13.5), 13_Interface_Options (R136.2)
TPU_SD_ALARM: 06_8MPLUS_IO (U2.B4), 12_Coral_Edge_TPU (J6.5 Q1.1)
USNOR_QSPI_DATA0: 06_8MPLUS_IO (U2.R25), 09_eMMC_Flash (TP57.TP U6.D3)
USNOR_QSPI_DATA1: 06_8MPLUS_IO (U2.L25), 09_eMMC_Flash (TP56.TP U6.D2)
USNOR_QSPI_DATA2: 06_8MPLUS_IO (U2.L24), 09_eMMC_Flash (TP55.TP U6.C4)
USNOR_QSPI_DATA3: 06_8MPLUS_IO (U2.N24), 09_eMMC_Flash (TP54.TP U6.D4)
USNOR_QSPI_SCLK: 06_8MPLUS_IO (U2.N25), 09_eMMC_Flash (TP59.TP U6.B2)
USNOR_QSPI_SS0_B: 06_8MPLUS_IO (U2.L26), 09_eMMC_Flash (R65.1 TP58.TP U6.C2)
VCC5.0_SYS: 02_8MPLUS_PMIC (22 pins), 12_Coral_Edge_TPU (R129.1 R133.1), 14_BTB_Connector_P1-P100 (7 pins), 15_BTB_Connector_P101-P200 (5 pins), 16_FPC_Connector_Debug (5 pins)
VSNOR_SPI_MISO: 06_8MPLUS_IO (U2.AF6), 09_eMMC_Flash (TP50.TP U7.2), 16_FPC_Connector_Debug (J5.24)
VSNOR_SPI_MOSI: 06_8MPLUS_IO (U2.AJ3), 09_eMMC_Flash (TP51.TP U7.5), 16_FPC_Connector_Debug (J5.23)
VSNOR_SPI_SCLK: 06_8MPLUS_IO (U2.AD6), 09_eMMC_Flash (TP52.TP U7.6), 16_FPC_Connector_Debug (J5.22)
VSNOR_SPI_SS0: 06_8MPLUS_IO (U2.AH4), 09_eMMC_Flash (R62.1 TP53.TP U7.1), 16_FPC_Connector_Debug (J5.21)
VSNOR_SPI_~{WP}: 09_eMMC_Flash (R64.1 TP49.TP U7.3), 14_BTB_Connector_P1-P100 (J3.20), 16_FPC_Connector_Debug (J5.25)
WDOG_B: 02_8MPLUS_PMIC (R5.2 TP13.TP U1.28), 06_8MPLUS_IO (U2.B6)
WIFI_USB_N: 07_8MPLUS_PHY (R44.2), 11_WIFI_BLE_Module (R113.1)
WIFI_USB_P: 07_8MPLUS_PHY (R45.2), 11_WIFI_BLE_Module (R114.1)
WIFI_WL_HOST_WAKE: 06_8MPLUS_IO (U2.AJ4), 11_WIFI_BLE_Module (U10.52)
WL_REG_EN: 06_8MPLUS_IO (U2.U26), 11_WIFI_BLE_Module (C176.1 R105.1 U10.4), 14_BTB_Connector_P1-P100 (J3.89)

## Assembly variants
Default_Config_0: not fitted C182 C183 C184 C185 C186 C187 C188 C189 C190 C191 C198 J2 J6 L10 Q1 R1 R2 R18 R19 R20 R21 R22 R23 R44 R45 R49 R50 R52 R53 R56 R57 R58 R59 R60 R61 R62 R70 R71 R72 R74 R80 R84 R85 R86 R92 R96 R100 R101 R102 R104 R107 R108 R109 R110 R111 R115 R122 R125 R127 R128 R129 R130 R131 R132 R133 R134 R135 R136 R137 R138 R139 R140 R141 R159 R185 U13 U14 U15
TPU: not fitted C186 J2 R1 R2 R18 R19 R20 R21 R22 R23 R44 R45 R49 R50 R52 R53 R56 R57 R58 R59 R60 R61 R62 R70 R71 R72 R74 R80 R84 R85 R86 R92 R96 R100 R101 R102 R104 R107 R108 R109 R110 R111 R115 R122 R125 R136 R137 R138 R139 R140 R141 R159